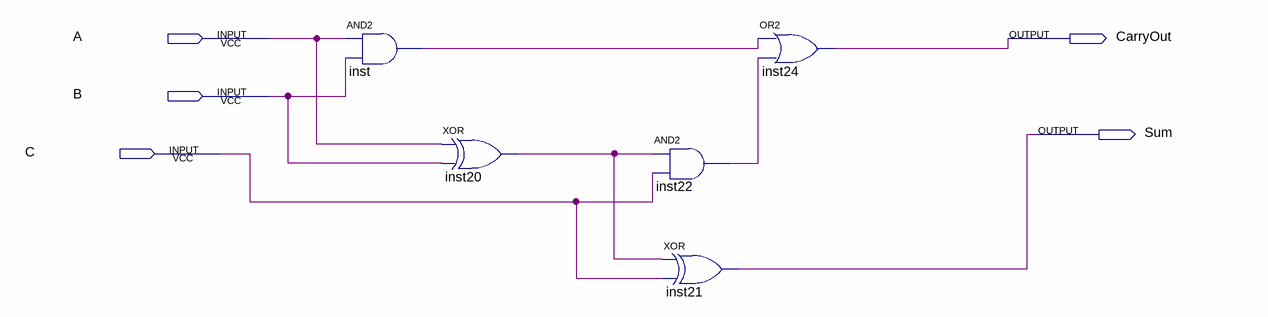
[diagram p0: schematic sheet]
// Quartus schematic fulladder.bdf as structural Verilog: 5 symbols, 5 pins
module fulladder (
  input  A,
  input  B,
  input  C,
  output CarryOut,
  output Sum
);

  wire inst20_out, inst22_out, inst_out;

  and inst (inst_out, A, B);
  xor inst20 (inst20_out, A, B);
  and inst22 (inst22_out, inst20_out, C);
  xor inst21 (Sum, inst20_out, C);
  or inst24 (CarryOut, inst_out, inst22_out);
endmodule
